# EAGLE schematic ModuleSMD (EAGLE 9.4.2)
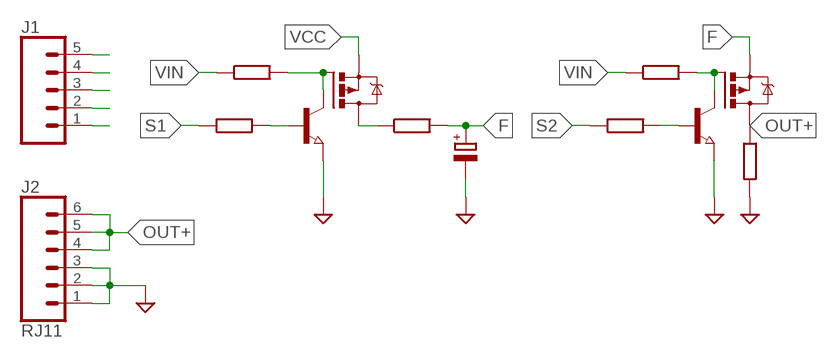
[diagram p0: schematic, sheet 1]

## Parts
C1  CPOL-EU150CLZ-1010  [150CLZ-1010]
J1  CONN_05  [1X05]
J2  RJ11  RJ11-6  [RJ11-6]
Q1  IRFR5305  [D-PAK_TO252AA]
Q2  IRFR5305  [D-PAK_TO252AA]
Q3  NPN-TRANSISTOR_SOT23  [SOT23]
Q4  NPN-TRANSISTOR_SOT23  [SOT23]
R1  R-EU_01005  [R01005]
R2  R-EU_01005  [R01005]
R3  R-EU_01005  [R01005]
R4  R-EU_01005  [R01005]
R5  R-EU_01005  [R01005]
R6  R-EU_01005  [R01005]

## Nets
F: C1.+ Q2.3(S) R5.2
GND: C1.- J2.1 J2.2 J2.3 Q3.2(E) Q4.2(E) R6.2
N$1: Q1.1(G) Q3.3(C) R1.2
N$2: Q3.1(B) R3.2
N$3: Q1.4(D) R5.1
N$5: Q2.1(G) Q4.3(C) R2.2
N$6: Q4.1(B) R4.2
N$8: J1.5
N$9: J1.4
N$10: J1.3
N$11: J1.2
N$12: J1.1
OUT+: J2.4 J2.5 J2.6 Q2.4(D) R6.1
S1: R3.1
S2: R4.1
VCC: Q1.3(S)
VIN: R1.1 R2.1

## Library data of the parts
C1 = rcl:CPOL-EU: POLARIZED CAPACITOR, European symbol; SPICEPREFIX: C
J1 = SparkFun-Connectors:CONN_05: Multi connection point. Often used as Generic Header-pin footprint for 0.1 inch spaced/style header connections On any of the 0.1 inch spaced packages, you can populate with these: Break Away Headers - Straight <https://www.sparkfun.com/products/116> (PRT-00116) Break Away Male Headers - Right Angle <https://www.sparkfun.com/products/553> (PRT-00553) Female Headers <https://www.sparkfun.com/products/115> (PRT-00115) Break Away Headers - Machine Pin <https://www.sparkfun.com/products/117> (PRT-00117) Break Away Female Headers - Swiss Machine Pin <https://www.sparkfun.com/products/743> (PRT-00743) For SCREWTERMINALS and SPRING TERMINALS visit here: Screw Terimnals on SparkFun.com <https://www.sparkfun.com/search/results?term=Screw+Terminals> (5mm/3.5mm/2.54mm spacing) This device is also useful as a general connection point to wire up your design to another part of your project. Our various solder wires solder well into these plated through hole pads. Hook-Up Wire - Assortment (Stranded, 22 AWG) <https://www.sparkfun.com/products/11375> (PRT-11375) Hook-Up Wire - Assortment (Solid Core, 22 AWG) <https://www.sparkfun.com/products/11367> (PRT-11367) View the entire wire category on our website here <https://www.sparkfun.com/categories/141> Special notes: Molex polarized connector foot print use with SKU : PRT-08231 with associated crimp pins and housings. 1MM SMD Version SKU: PRT-10208
J2 = SparkFun-Connectors:RJ11-6: RJ11 Jack - 6 pin Commonly found on CAT3 devices and some Microchip programmers. Here is the connector we sell at SparkFun: RJ11 6-Pin Connector <https://www.sparkfun.com/products/132> (PRT-00132) Datasheet <http://www.sparkfun.com/datasheets/Prototyping/Connectors/RJ11-Datasheet.pdf> It is used on this SparkFun product: SparkFun Weather Shield <https://www.sparkfun.com/products/12081> (DEV-12081) Weather Meters <https://www.sparkfun.com/products/8942> (SEN-08942); PROD_ID: CONN-08590; SF_ID: PRT-00132
Q1 Q2 = transistor-power:IRF?5305: HEXFET Power MOSFET Source: http://www.irf.com/product-info/datasheets/data/irfr5305pbf.pdf
Q3 Q4 = semicon-smd-ipc:NPN-TRANSISTOR_: NPN TRANSISTOR
R1-R6 = rcl:R-EU_: RESISTOR, European symbol; SPICEPREFIX: R